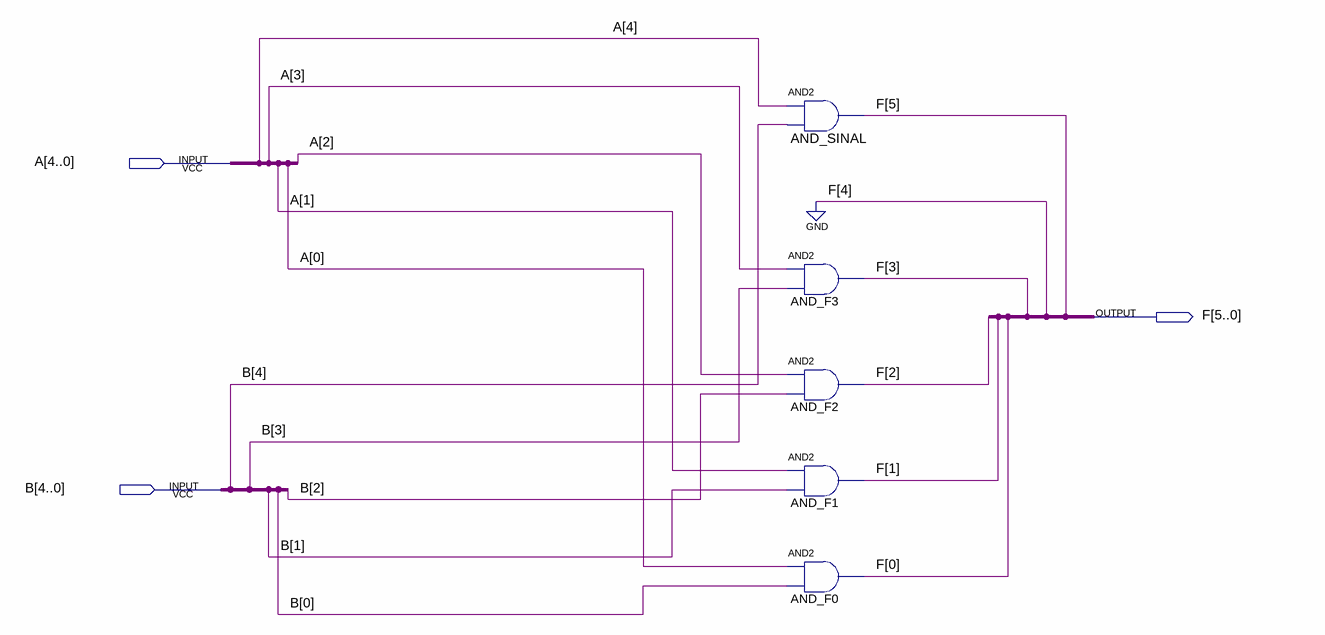
[diagram p0: schematic sheet]
// Quartus schematic CircuitoAND.bdf as structural Verilog: 5 symbols, 3 pins
module CircuitoAND (
  input  [4:0] A,
  input  [4:0] B,
  output [5:0] F
);

  and AND_SINAL (F[5], A[4], B[4]);
  and AND_F3 (F[3], A[3], B[3]);
  and AND_F2 (F[2], A[2], B[2]);
  and AND_F1 (F[1], A[1], B[1]);
  and AND_F0 (F[0], A[0], B[0]);

  assign F[4] = 1'b0;
endmodule
